# Altium schematic sheet totaal.SchDoc
size A4; SheetNumber: 1; SheetTotal: 2
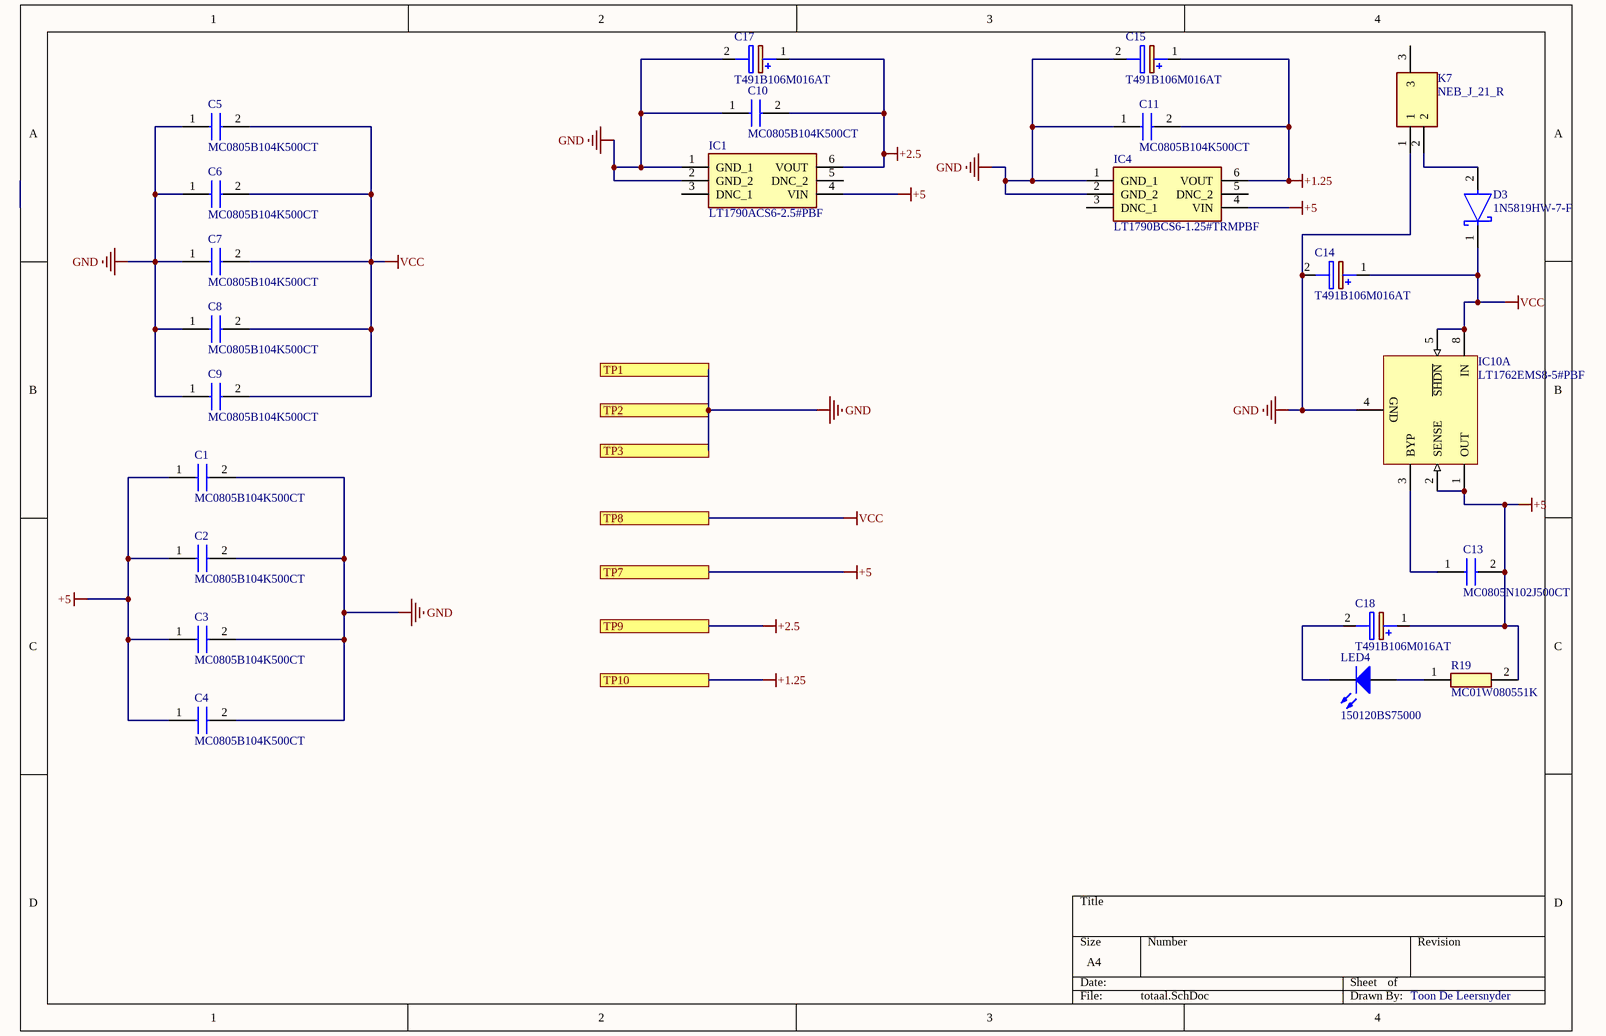
[diagram p0: totaal.SchDoc]

## Parts
C1  MC0805B104K500CT  [CAPC2012X90N]
C2  MC0805B104K500CT  [CAPC2012X90N]
C3  MC0805B104K500CT  [CAPC2012X90N]
C4  MC0805B104K500CT  [CAPC2012X90N]
C5  MC0805B104K500CT  [CAPC2012X90N]
C6  MC0805B104K500CT  [CAPC2012X90N]
C7  MC0805B104K500CT  [CAPC2012X90N]
C8  MC0805B104K500CT  [CAPC2012X90N]
C9  MC0805B104K500CT  [CAPC2012X90N]
C10  MC0805B104K500CT  [CAPC2012X90N]
C11  MC0805B104K500CT  [CAPC2012X90N]
C13  MC0805N102J500CT  [CAPC2012X90N]
C14  T491B106M016AT  [CAPPM3528X210N]
C15  T491B106M016AT  [CAPPM3528X210N]
C17  T491B106M016AT  [CAPPM3528X210N]
C18  T491B106M016AT  [CAPPM3528X210N]
D3  1N5819HW-7-F  [FP-SOD123-IPC_B]
IC1  LT1790ACS6-2.5#PBF  [SOT95P280X100-6N]
IC4  LT1790BCS6-1.25#TRMPBF  [LT1790BCS6125TRMPBF]
IC10  LT1762EMS8-5#PBF  [LT-MS8_N]  (part A of 2)
K7  NEB_J_21_R  [NEBJ21R]
LED4  150120BS75000  [1206_A]
R19  MC01W080551K  [RESC2014X65N]

## Ports
TP1, TP2, TP3, TP7, TP8, TP9, TP10

## Nets
+1.25: C11.2 C15.1(+) IC4.6(VOUT) ; port TP10
+2.5: C10.2 C17.1(+) IC1.6(VOUT) ; port TP9
+5: C1.1 C2.1 C3.1 C4.1 C13.2 C18.1(+) IC1.4(VIN) IC4.4(VIN) IC10.1(OUT) IC10.2(SENSE) R19.2 ; port TP7
GND: C1.2 C2.2 C3.2 C4.2 C5.1 C6.1 C7.1 C8.1 C9.1 C10.1 C11.1 C14.2(-) C15.2(-) C17.2(-) IC1.1(GND_1) IC1.2(GND_2) IC4.1(GND_1) IC4.2(GND_2) IC10.4(GND) K7.1 ; port TP2, port TP3, port TP1
VCC: C5.2 C6.2 C7.2 C8.2 C9.2 C14.1(+) D3.1(C) IC10.5(~{SHDN}) IC10.8(IN) ; port TP8
NetC13_1: C13.1 IC10.3(BYP)
NetC18_2: C18.2(-) LED4.1(K)
NetD3_2: D3.2(A) K7.2
NetLED4_2: LED4.2(A) R19.1

Not connected (* = marked no-connect by the designer): IC1 3(DNC_1) 5(DNC_2); IC4 3(DNC_1) 5(DNC_2); K7 3

## Notes on the sheet
- Toon De Leersnyder

## Library data of the parts
C1-C11 = MC0805B104K500CT: Capacitor; Manufacturer_Name: MULTICOMP; Datasheet Link: https://componentsearchengine.com/Datasheets/2/MC0805B104K500CT.pdf; Height: 0.9mm; Manufacturer_Part_Number: MC0805B104K500CT
C13 = MC0805N102J500CT: Capacitor; Manufacturer_Name: MULTICOMP; Datasheet Link: http://www.farnell.com/datasheets/1901289.pdf; Height: 0.9mm; Manufacturer_Part_Number: MC0805N102J500CT
C14 C15 C17 C18 = T491B106M016AT: Capacitor Polarised; Manufacturer_Name: Kemet; Datasheet Link: https://componentsearchengine.com/Datasheets/2/T491B106M016AT.pdf; Height: 2.1mm; Manufacturer_Part_Number: T491B106M016AT; Mouser Part Number: 80-T491B106M016; Mouser Price/Stock: https://www.mouser.co.uk/ProductDetail/KEMET/T491B106M016AT?qs=WydH9nGI6cAnkEyQJLjSzA%3D%3D; Arrow Part Number: T491B106M016AT; Arrow Price/Stock: https://www.arrow.com/en/products/t491b106m016at/kemet-corporation
D3 = CMP-0303-00003-3: DIODE SCHOTTKY 40V 1A SOD123; Forward Voltage: 450mV; Capacitance: 110pF; Max Forward Surge Current (Ifsm): 25A; Peak Reverse Current: 50uA; Polarity: Standard; Element Configuration: Single; Max Power Dissipation: 450mW; Min Operating Temperature: -65°C; Package Quantity: 3000; Contact Plating: Tin; Weight: 0.000353oz; Max Repetitive Reverse Voltage (Vrrm): 40V; Max Reverse Voltage (DC): 40V; Height: 1.25mm; Average Rectified Current: 1A; Width: 1.7mm; Case/Package: SOD-123-2; Lead Free: Lead Free; Max Operating Temperature: 125°C; Current Rating: 1A; Termination: SMD/SMT; Forward Current: 1A; Radiation Hardening: No; Number of Pins: 2; Length: 2.85mm; Voltage Rating (DC): 40V; REACH SVHC: No SVHC; Peak Non-Repetitive Surge Current: 25A; Packaging: Tape and Reel; Output Current: 1A
IC1 = LT1790ACS6-2.5#PBF: Integrated Circuit; Manufacturer_Name: Linear Technology; Datasheet Link: https://componentsearchengine.com/Datasheets/2/LT1790ACS6-2.5#PBF.pdf; Height: 1mm; Manufacturer_Part_Number: LT1790ACS6-2.5#PBF; Mouser Part Number: 584-1790ACS6-2.5PBF; Mouser Price/Stock: https://www.mouser.com/Search/Refine.aspx?Keyword=584-1790ACS6-2.5PBF
IC4 = LT1790BCS6-1.25#TRMPBF: Integrated Circuit; Manufacturer_Name: Analog Devices; Datasheet Link: https://www.arrow.com/en/products/lt1790bcs6-1.25trmpbf/analog-devices; Height: 1mm; Manufacturer_Part_Number: LT1790BCS6-1.25#TRMPBF; Mouser Part Number: 584-1790BCS61.25TMPF; Mouser Price/Stock: https://www.mouser.co.uk/ProductDetail/Analog-Devices/LT1790BCS6-125TRMPBF/?qs=ytflclh7QUXpPD13KZ8jjg%3D%3D; Arrow Part Number: LT1790BCS6-1.25#TRMPBF; Arrow Price/Stock: https://www.arrow.com/en/products/lt1790bcs6-1.25trmpbf/analog-devices
IC10 = CMP-0476-00707-1: 150 mA, Low Noise, LDO Micropower Regulator, 1.8 to 20 V Vin, 5 V Vout, 8-pin SOP (MS8-8), -40 to 125 degC, Pb-Free; Manufacturer: Linear Technology; Iout(mA): 150; Output Voltage: 5 V; Isupply(mA): 0.025; Noise(uV): 20; Number of Outputs: 1; PSRR(dB): 65; Vin Min(V): 1.8; Dropout Voltage(V): 0.27; Discrete Pass Element: no; Mounting Technology: Surface Mount; ComponentLink3URL: http://cds.linear.com/docs/en/packaging/05081660_G_MS8.pdf; DatasheetVersion: Rev. A; PackageDescription: 8-Pin Plastic MSOP, Body 3 x 3 mm, Pitch 0.65 mm; RoHS: TRUE; PartNumber: LT1762EMS8-5#PBF; ComponentLink2URL: http://cds.linear.com/docs/en/datasheet/1762fa.pdf; PackageReference: MS8; PackageVersion: Rev. G, 05/2013; ComponentLink2Description: Datasheet; ComponentLink3Description: Package Specification; ComponentLink1Description: Manufacturer URL; Shutdown Current(uA): 1; Vin Max(V): 20; ComponentLink1URL: http://www.linear.com/
K7 = NEB_J_21_R: Connector; Manufacturer_Name: LUMBERG; Manufacturer_Part_Number: NEB/J 21 R; Datasheet Link: http://www.farnell.com/datasheets/2047481.pdf?_ga=2.269136052.479969064.1560760329-167411096.1502103357; Height: 8mm
LED4 = CMP-1426-00015-1: SMD mono-color Chip LED, WL-SMCW, Blue; Manufacturer: Wuerth Elektronik; ComponentLink2Description: Datasheet; ComponentLink1URL: http://www.we-online.com; PartNumber: 150120BS75000; ComponentLink1Description: Manufacturer URL; ComponentLink2URL: http://katalog.we-online.com/led/datasheet/150120BS75000.pdf; PackageReference: 1206_A; Color: Blue
R19 = MC01W080551K: Resistor; Manufacturer_Name: MULTICOMP; Datasheet Link: http://www.farnell.com/datasheets/1729047.pdf; Height: 0.65mm; Manufacturer_Part_Number: MC01W080551K